# Altium schematic sheet SPI.SchDoc: StrayCAT - SPI
size A4; Organization: Cyrola Incorporated; Address1: WeWork Namba SkyO; Address2: 27th Floor, Namba 5-1-60; Address3: Chuo-ku, Osaka; Address4: 542-0076, JAPAN; DocumentNumber: CR22-1128; Revision: 1; SheetNumber: 1; SheetTotal: 2; PageSetup: Record=PageOptions|CenterHorizontal=True|CenterVertical=True|PrintScale=1.00|XCorrection=1.00|YCorrection=1.00|PrintKind=0|BorderSize=5000000|LeftOffset=0|BottomOffset=0|Orientation=2|PaperLength=1000|PaperWidth=1000|Scale=100|PaperSource=7|PrintQuality=-3|MediaType=1|DitherType=10|PrintScaleMode=1|PaperKind=A4|PaperIndex=9
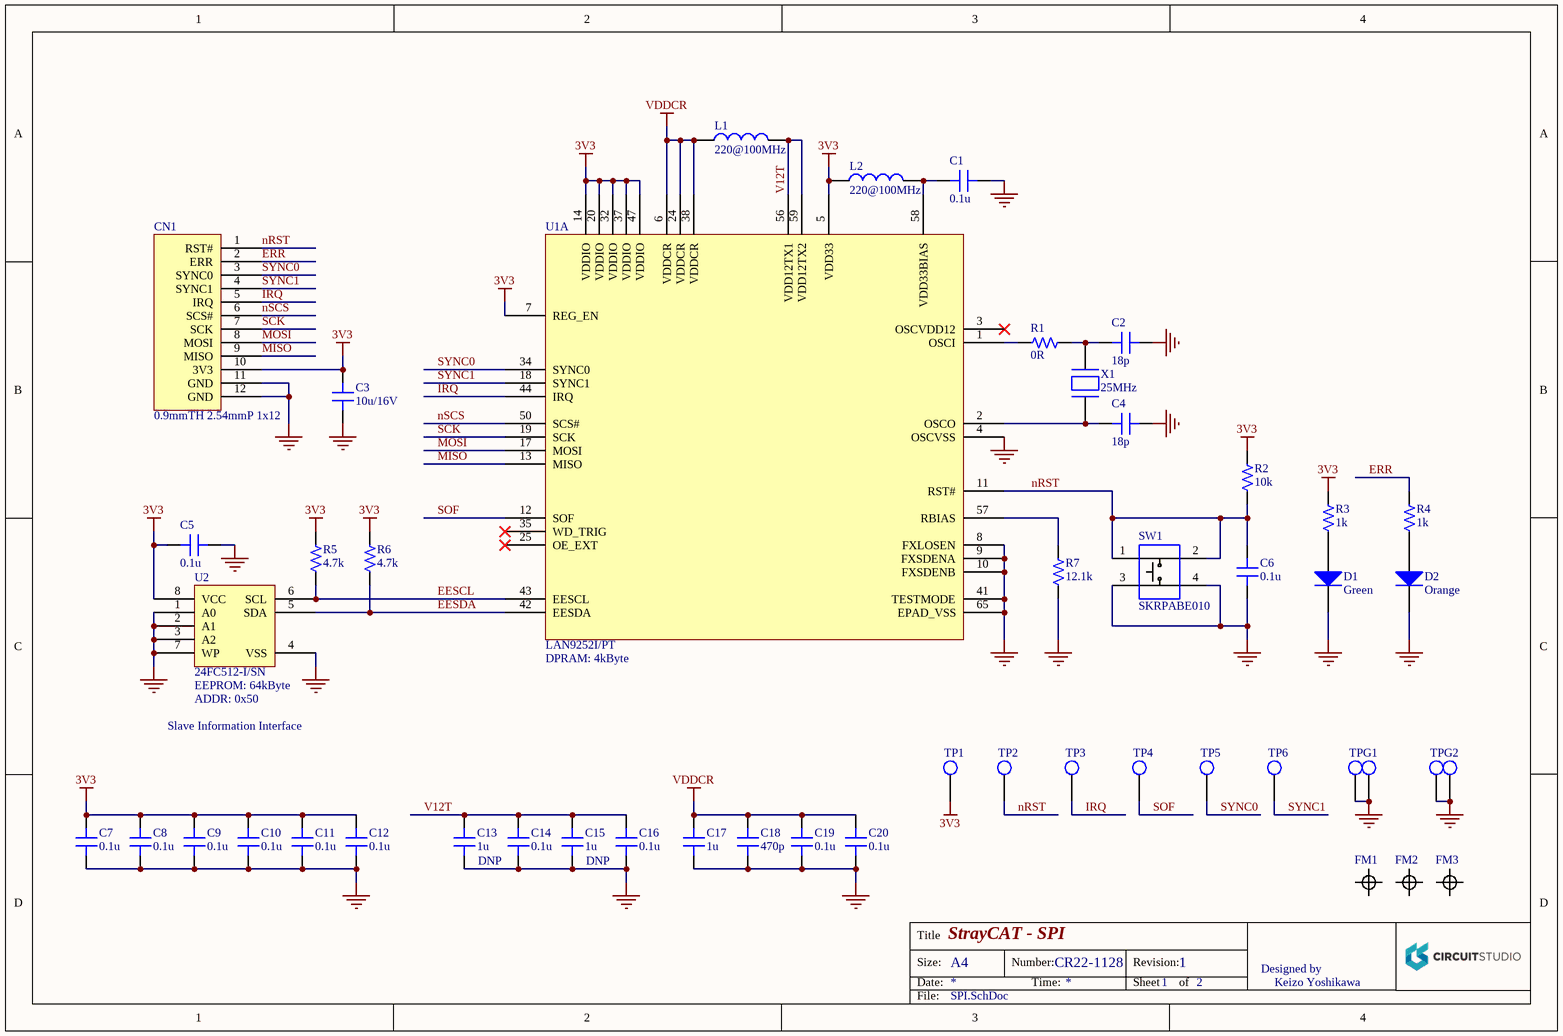
[diagram p0: SPI.SchDoc]

## Parts
C1  0.1u  [CGA3]
C2  18p  [CGA3]
C3  10u/16V  [CGA4]
C4  18p  [CGA3]
C5  0.1u  [CGA3]
C6  0.1u  [CGA3]
C7  0.1u  [CGA3]
C8  0.1u  [CGA3]
C9  0.1u  [CGA3]
C10  0.1u  [CGA3]
C11  0.1u  [CGA3]
C12  0.1u  [CGA3]
C13  1u  [CGA3]
C14  0.1u  [CGA3]
C15  1u  [CGA3]
C16  0.1u  [CGA3]
C17  1u  [CGA3]
C18  470p  [CGA3]
C19  0.1u  [CGA3]
C20  0.1u  [CGA3]
CN1  0.9mmTH 2.54mmP 1x12  [61301211121]
D1  Green  [DIOC2012X08N]
D2  Orange  [DIOC2012X08N]
FM1  FIDUCIAL_MARK  [Fiducial Mark]  (value not drawn)
FM2  FIDUCIAL_MARK  [Fiducial Mark]  (value not drawn)
FM3  FIDUCIAL_MARK  [Fiducial Mark]  (value not drawn)
L1  220@100MHz  [BLM18EG221SN1D]
L2  220@100MHz  [BLM18EG221SN1D]
R1  0R  [RK73x1J]
R2  10k  [RK73x1J]
R3  1k  [RK73x1J]
R4  1k  [RK73x1J]
R5  4.7k  [RK73x1J]
R6  4.7k  [RK73x1J]
R7  12.1k  [RK73x1J]
SW1  SKRPABE010  [SKRPABE010]
TP1  3V3  [TEST_POINT]  (value not drawn)
TP2  nRST  [TEST_POINT]  (value not drawn)
TP3  IRQ  [TEST_POINT]  (value not drawn)
TP4  SOF  [TEST_POINT]  (value not drawn)
TP5  SYNC0  [TEST_POINT]  (value not drawn)
TP6  SYNC1  [TEST_POINT]  (value not drawn)
TPG1  TEST_POINT2  [TEST_POINT2]  (value not drawn)
TPG2  TEST_POINT2  [TEST_POINT2]  (value not drawn)
U1  LAN9252I/PT  [TSQFP50P1200X1200X105_HS-65N]  (part A of 2)
U2  24FC512-I/SN  [24FC512-I_SN]
X1  25MHz  [CSM1Z-A5B2C5-40-25_0D18-F]

## Nets
3V3: C3.1 C5.1 C7.1 C8.1 C9.1 C10.1 C11.1 C12.1 CN1.10(3V3) L2.1 R2.1 R3.1 R5.1 R6.1 TP1.1 U1.5(VDD33) U1.7(REG_EN) U1.14(VDDIO) U1.20(VDDIO) U1.32(VDDIO) U1.37(VDDIO) U1.47(VDDIO) U2.8(VCC)
GND: C1.2 C2.2 C3.2 C4.2 C5.2 C6.2 C7.2 C8.2 C9.2 C10.2 C11.2 C12.2 C13.2 C14.2 C15.2 C16.2 C17.2 C18.2 C19.2 C20.2 CN1.11(GND) CN1.12(GND) D1.2(K) D2.2(K) R7.2 SW1.3 SW1.4 TPG1.1 TPG1.2 TPG2.1 TPG2.2 U1.4(OSCVSS) U1.8(FXLOSEN) U1.9(FXSDENA) U1.10(FXSDENB) U1.41(TESTMODE) U1.65(EPAD_VSS) U2.1(A0) U2.2(A1) U2.3(A2) U2.4(VSS) U2.7(WP)
VDDCR: C17.1 C18.1 C19.1 C20.1 L1.1 U1.6(VDDCR) U1.24(VDDCR) U1.38(VDDCR)
EESCL: R5.2 U1.43(EESCL) U2.6(SCL)
EESDA: R6.2 U1.42(EESDA) U2.5(SDA)
ERR: CN1.2(ERR) R4.1
IRQ: CN1.5(IRQ) TP3.1 U1.44(IRQ)
MISO: CN1.9(MISO) U1.13(MISO)
MOSI: CN1.8(MOSI) U1.17(MOSI)
nRST: C6.1 CN1.1(RST#) R2.2 SW1.1 SW1.2 TP2.1 U1.11(RST#)
nSCS: CN1.6(SCS#) U1.50(SCS#)
SCK: CN1.7(SCK) U1.19(SCK)
SOF: TP4.1 U1.12(SOF)
SYNC0: CN1.3(SYNC0) TP5.1 U1.34(SYNC0)
SYNC1: CN1.4(SYNC1) TP6.1 U1.18(SYNC1)
V12T: C13.1 C14.1 C15.1 C16.1 L1.2 U1.56(VDD12TX1) U1.59(VDD12TX2)
NetC1_1: C1.1 L2.2 U1.58(VDD33BIAS)
NetC2_1: C2.1 R1.2 X1.1
NetC4_1: C4.1 U1.2(OSCO) X1.2
NetD1_1: D1.1(A) R3.2
NetD2_1: D2.1(A) R4.2
NetR1_1: R1.1 U1.1(OSCI)
NetR7_1: R7.1 U1.57(RBIAS)

Not connected (* = marked no-connect by the designer): U1 3(OSCVDD12)* 25(OE_EXT)* 35(WD_TRIG)*

## Notes on the sheet
- (near U2) ADDR: 0x50
- (near U2) EEPROM: 64kByte
- (near U1) DPRAM: 4kByte
- Slave Information Interface
- DNP
- Title
- Size:
- Date:
- A4
- Number:
- Time:
- Revision:
- Sheet
- of
- Designed by
- Keizo Yoshikawa
- File:

## Library data of the parts
C1 C5-C12 C14 C16 C19 C20 = CGA3E2X7R1H104K080AA: 1608 0.1uF 50V X7R 10%
C2 C4 = CGA3E2C0G1H180J080AA: 1608 18pF 50V C0G 5%
C3 = CGA4J1X5R1C106K125AC: 2012 10uF 16V X5R 10%
C13 C15 C17 = CGA3E1X7R1E105K080AC: 1608 1uF 25V X7R 10%
C18 = CGA3E2C0G1H471J080AA: 1608 470pF 50V C0G 5%
CN1 = 61301211121: WR-PHD Pin Header 12pin
D1 = APT2012QGW: 2012 Chip LED Green
D2 = APT2012NW: 2012 Chip LED Orange
L1 L2 = BLM18EG221SN1D: Noise Suppression Chip Ferrite Bead
R1 = RK73Z1JTTD: 1608 0-Ohm 1A
R2 = RK73B1JTTD103J: 1608 10kOhm 5% 1/10W
R3 R4 = RK73B1JTTD102J: 1608 1kOhm 5% 1/8W
R5 R6 = RK73B1JTTD472J: 1608 4.7kOhm 5% 1/10W
R7 = RK73H1JTTD1212F: 1608 12.1kOhm 1% 1/10W
SW1 = SKRPABE010: SPST Switch N/O 1.57N
TP1-TP6 = TEST_POINT: 0.9mmH Through-Hole
TPG1 TPG2 = TEST_POINT2: 0.9mmH Through-Hole
U1 = LAN9252I_PT: EtherCAT Slave Controller
U2 = 24FC512-I_SN: 512kBit I2C Serial EEPROM
X1 = CSM1Z-A5B2C5-40-25_0D18-F: HC-49S 25MHz Crystal